# Altium schematic sheet 参考电路.SchDoc
size 292 x 193 mm; Author: Power Lin; SheetNumber: 1; SheetTotal: 1; Website: wiki-power.com
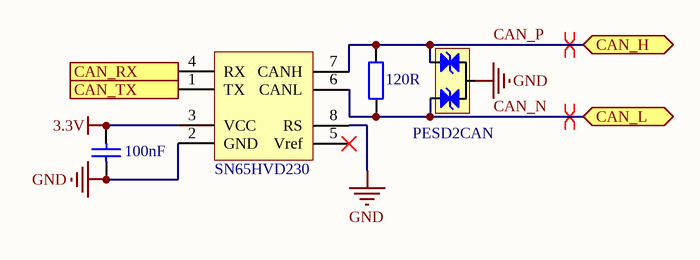
[diagram p0: 参考电路.SchDoc]

## Parts
C?  100nF  [CAP-0603]
D?  PESD2CAN  [SOT-23-3]
R?  120R  [R-0603]
U?  SN65HVD230  [SOIC_8]

## Ports
CAN_H (bidir), CAN_L (bidir), CAN_RX (in), CAN_TX (out)

## Nets
3.3V: C?.2 U?.3(VCC)
GND: C?.1 D?.3 U?.2(GND) U?.8(RS)
CAN_N: D?.1 R?.1 U?.6(CANL) ; port CAN_L
CAN_P: D?.2 R?.2 U?.7(CANH) ; port CAN_H
CAN_RX: U?.4(RX) ; port CAN_RX
CAN_TX: U?.1(TX) ; port CAN_TX

Not connected (* = marked no-connect by the designer): U? 5(Vref)*

## Layout directives
differential pair: CAN_N, CAN_P

## Notes on the sheet
- Author
- DocumentName
- ModifiedDate
- ProjectName
- SheetNumber
- SheetTotal
- Website
- Revision

## Library data of the parts
C? = CAP: 贴片电容; ComponentLink1Description: 供应商链接; ComponentLink1URL: http://www.szlcsc.com/product/details_53938.html; Package: 0402; Supplier: LC; SuppliersPartNumber: C52923
D? = TVS_C2: TVS 双向x2
R? = RES: 贴片电阻; Package: 0805; Supplier: LC; SuppliersPartNumber: C17798
U? = SN65HVD230DR: CAN 控制器（3.3V）